# EAGLE schematic dispo_domot (EAGLE 7.2.0)
CDESIGNER: Apellido, Nombre; CNAME: DISPOSITIVO DOMOTICO; CREVISION: 1.0; CSCHO: ESCUELA
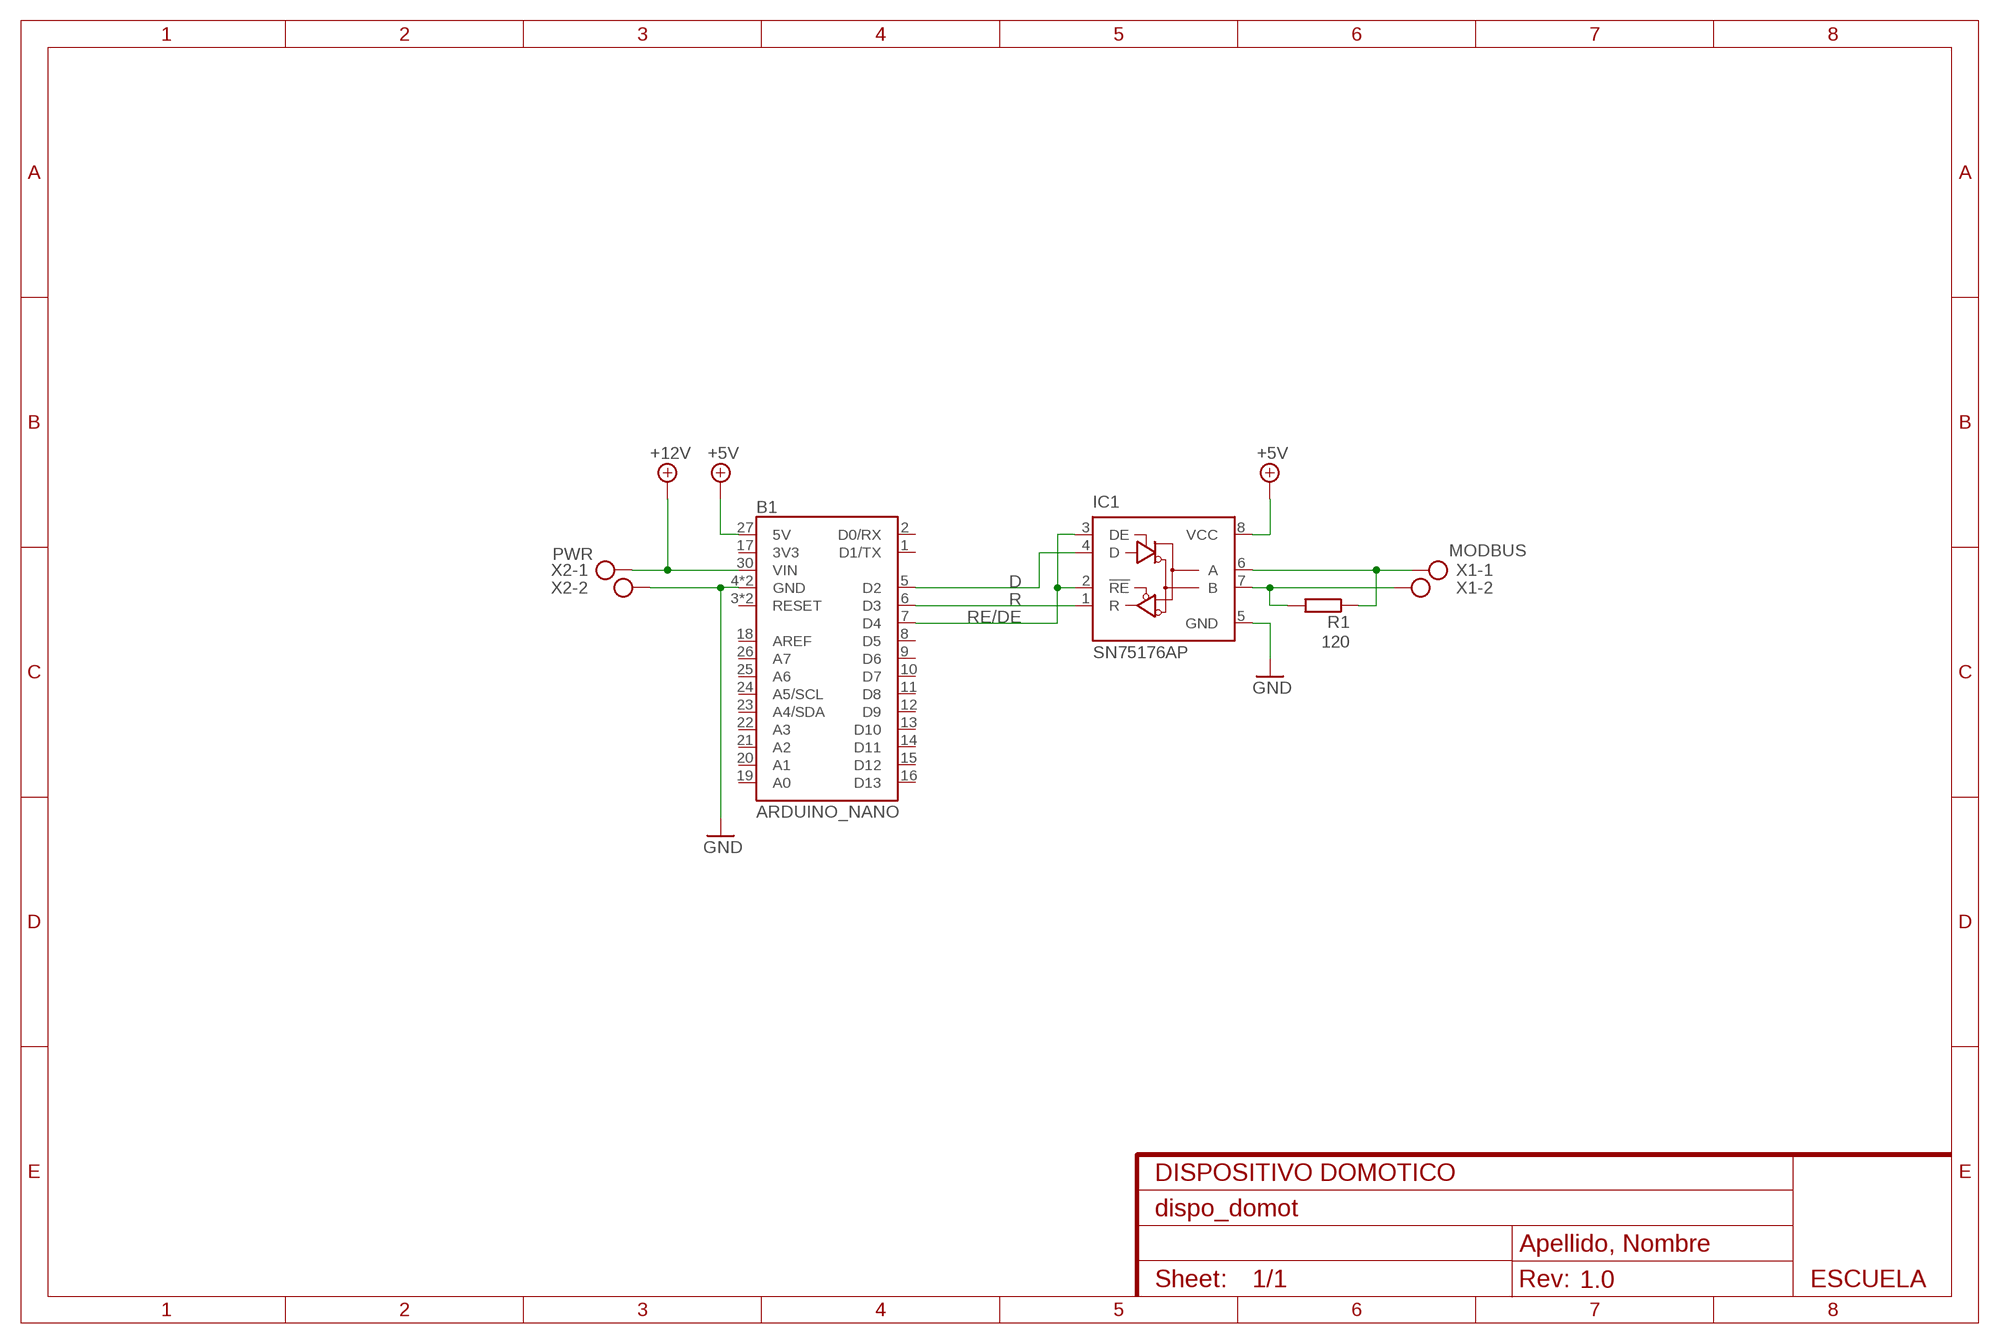
[diagram p0: schematic, sheet 1]

## Parts
B1  ARDUINO_NANO  [NANO]
IC1  SN75176AP  [DIL08]
R1  120  RESISTOR-EU0204/7  [0204/7]
X1  MODBUS  BORNERA_AK500/2  [AK500/2]
X2  PWR  BORNERA_AK500/2  [AK500/2]

## Nets
+5V: B1.27(5V) IC1.8(VCC)
+12V: B1.30(VIN) X2.1
D: B1.5(D2) IC1.4(D)
GND: B1.4(GND) B1.29(GND) IC1.5(GND) X2.2
N$4: IC1.6(A) R1.1 X1.1
N$5: IC1.7(B) R1.2 X1.2
R: B1.6(D3) IC1.1(R)
RE/DE: B1.7(D4) IC1.2(!RE) IC1.3(DE)
Unconnected: B1.1(D1/TX) B1.2(D0/RX) B1.3(RESET) B1.8(D5) B1.9(D6) B1.10(D7) B1.11(D8) B1.12(D9) B1.13(D10) B1.14(D11) B1.15(D12) B1.16(D13) B1.17(3V3) B1.18(AREF) B1.19(A0) B1.20(A1) B1.21(A2) B1.22(A3) B1.23(A4/SDA) B1.24(A5/SCL) B1.25(A6) B1.26(A7) B1.28(RESET)

## Library data of the parts
B1 = treser_lib:ARDUINO_NANO: Arduino Nano
IC1 = treser_lib:SN75176A: Bus RS-485
R1 = treser_lib:RESISTOR-EU: Resistor Simbolo europeo.
X1 X2 = treser_lib:BORNERA_AK500/2: Bornera de tornillo; OC_FARNELL: unknown; OC_NEWARK: unknown